# EAGLE design bga614_lna (EAGLE 9.6.2)
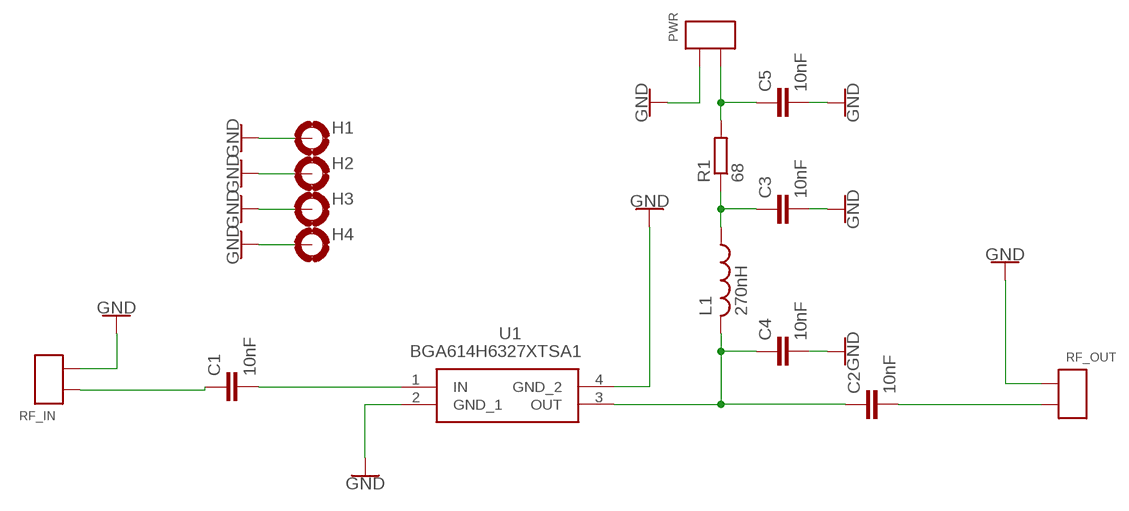
[diagram p0: schematic, sheet 1]

## Parts
C1  10nF  C_0805_SMD  [C0805]
C2  10nF  C_0805_SMD  [C0805]
C3  10nF  C_0805_SMD  [C0805]
C4  10nF  C_0805_SMD  [C0805]
C5  10nF  C_0805_SMD  [C0805]
H1  MOUNT-PAD-ROUND3.0  [3,0-PAD]
H2  MOUNT-PAD-ROUND3.0  [3,0-PAD]
H3  MOUNT-PAD-ROUND3.0  [3,0-PAD]
H4  MOUNT-PAD-ROUND3.0  [3,0-PAD]
L1  270nH  L_0805_PTH  [M0805]
PWR  2X_SMD_PTH_PIN  [2X_SMD_PTH]
R1  68  R_0805_SMD  [R0805W]
RF_IN  2X_SMD_PTH_PIN  [2X_SMD_PTH]
RF_OUT  2X_SMD_PTH_PIN  [2X_SMD_PTH]
U1  BGA614H6327XTSA1  [BGA614H6327XTSA1]

## Nets
GND: C3.2 C4.2 C5.2 H1.B3,0(MOUNT) H2.B3,0(MOUNT) H3.B3,0(MOUNT) H4.B3,0(MOUNT) PWR.P$1(PIN0) PWR.T$1(PIN0) RF_IN.P$2(PIN1) RF_IN.T$2(PIN1) RF_OUT.P$1(PIN0) RF_OUT.T$1(PIN0) U1.2(GND_1) U1.4(GND_2)
N$1: C2.1 C4.1 L1.2 L1.P$2 U1.3(OUT)
N$2: C3.1 L1.1 L1.P$1 R1.1
N$3: C5.1 PWR.P$2(PIN1) PWR.T$2(PIN1) R1.2
N$4: C2.2 RF_OUT.P$2(PIN1) RF_OUT.T$2(PIN1)
N$5: C1.2 U1.1(IN)
N$6: C1.1 RF_IN.P$1(PIN0) RF_IN.T$1(PIN0)

## Library data of the parts
C1-C5 = mylib:C_0805_SMD
H1-H4 = holes:MOUNT-PAD-ROUND: MOUNTING PAD, round
L1 = mylib:L_0805_PTH
PWR RF_IN RF_OUT = mylib:2X_SMD_PTH_PIN
R1 = mylib:R_0805_SMD
U1 = BGA614H6327XTSA1:BGA614H6327XTSA1: INFINEON - BGA614H6327XTSA1 - MMIC AMP, 17.5DB, 0-2.4GHZ, SOT-343-4 Source: Datasheet <https://www.infineon.com/dgdl/BGA614.pdf?folderId=db3a30431441fb5d0114b654e6581730&fileId=db3a304314dca3890115418ffd35163a>; ARROW_PART_NUMBER: BGA614H6327XTSA1; ARROW_PRICE-STOCK: https://www.arrow.com/en/products/bga614h6327xtsa1/infineon-technologies-ag; DESCRIPTION: INFINEON - BGA614H6327XTSA1 - MMIC AMP, 17.5DB, 0-2.4GHZ, SOT-343-4; HEIGHT: 1mm; MANUFACTURER_NAME: Infineon; MANUFACTURER_PART_NUMBER: BGA614H6327XTSA1; MOUSER_PART_NUMBER: 726-BGA614H6327XTSA1; MOUSER_PRICE-STOCK: https://www.mouser.co.uk/ProductDetail/Infineon-Technologies/BGA614H6327XTSA1?qs=K00xGehIljv3gDCSGhHKEQ%3D%3D

## Board
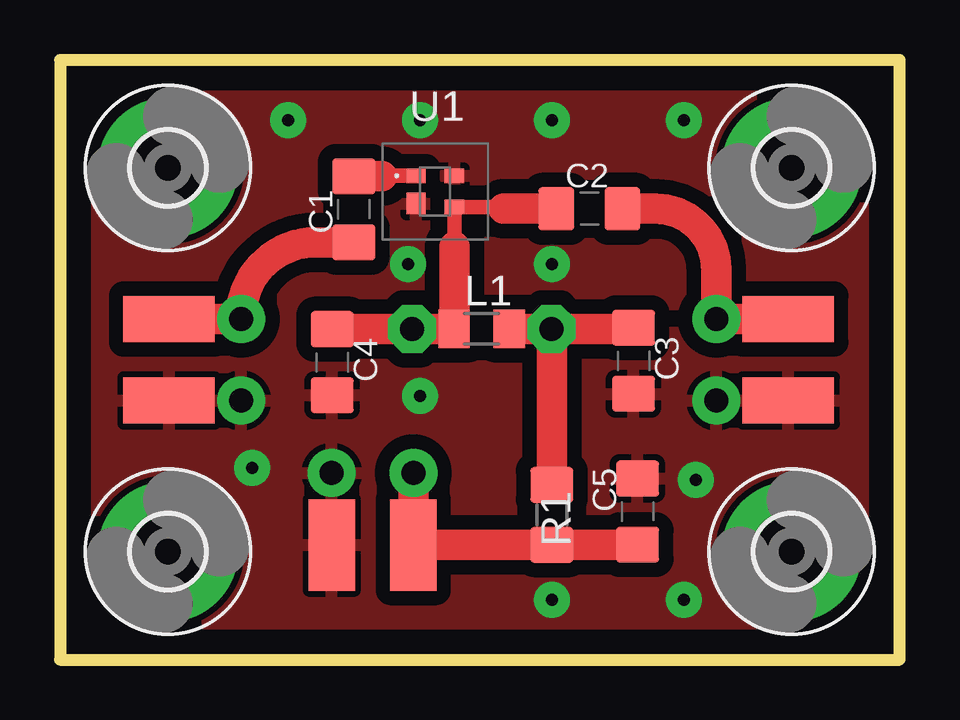
[diagram p1: board, top side]
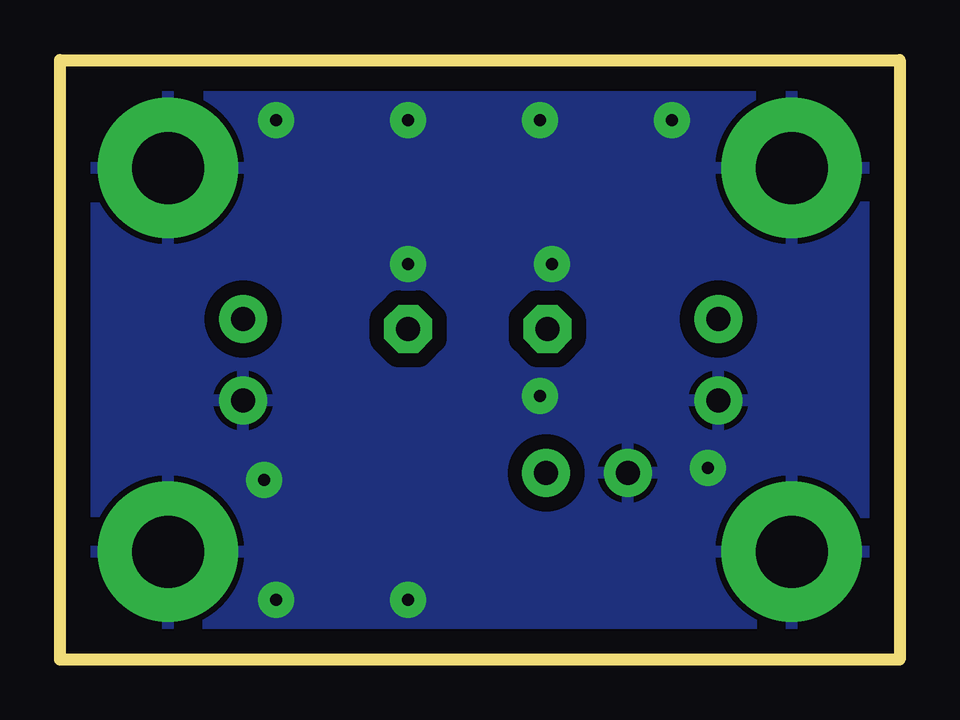
[diagram p2: board, bottom side, seen from below]

Size 35 x 25 mm. Coordinates in mm from the lower left corner, seen from the top.
Outline: 0,0 35,0 35,25 0,25 0,0
Copper layers (1*16): Top 0.035mm / dielectric 1.5mm / Bottom 0.035mm
Design rules "default": minimum track width 6mil, minimum drill 0.35mm, track to track 6mil, track to pad 6mil, pad to pad 6mil, via to via 6mil, smd to smd 6mil, copper to edge 40mil, drill to drill 6mil, minimum pad ring 10mil, minimum via ring 8mil, stop-mask expansion 4mil, vias tented up to drill 0mil, thermal gap 10mil

### Footprints (pad centres in the part's own frame; a part is rotated, then mirrored left to right if it is on the bottom)
C0805 = smd 1.5 x 1.8: 1 -1.377,0; 2 1.377,0
3,0-PAD = drill 3 pad 5.842: B3,0 0,0
M0805 = smd 1.3 x 1.6: 1 -1.15,0; 2 1.15,0 | drill 1 pad 2 octagon: P$1 -2.9,0; P$2 2.9,0
2X_SMD_PTH = smd 3.81 x 1.93: P$1 0,1.7; P$2 0,-1.7 | drill 1 pad 2: T$1 3,1.7; T$2 3,-1.7
R0805W = smd 1.5 x 1.8: 1 -1.252,0; 2 1.252,0
BGA614H6327XTSA1 = smd 0.6 x 0.8: 1 -0.65,-0.8; 3 0.65,0.8; 4 -0.65,0.8 | smd 0.9 x 0.8: 2 0.5,-0.8

### Placement (x,y rotation side)
C1  12.25,18.77 90 top
C2  22.07,18.8 0 top
C3  23.91,12.46 270 top
C4  11.35,12.4 270 top
C5  24.08,6.17 90 top
H1  30.5,4.5 0 top
H2  4.5,4.5 0 top
H3  4.5,20.5 0 top
H4  30.5,20.5 0 top
L1  17.58,13.79 180 top
PWR  13.03,4.78 90 top
R1  20.51,6.03 270 top
RF_IN  4.55,12.5 0 top
RF_OUT  30.36,12.5 180 top
U1  15.64,19.52 270 top

### Tracks (layer width: path | path; a pad name or v marks a point on that pad's centre or on a via)
GND  (via drill 0.5 pad 1.5)
  other vias: 9.5,22.5 15,22.5 20.5,22.5 26,22.5 26,2.5 20.5,2.5 8,8 15,11 20.5,16.5 14.5,16.5 26.5,7.5
  pour Top (isolate 0.6): 37,-2.5 -2,-2.5 -2,27 37,27
  pour Bottom (isolate 0.6): 36.5,-1.5 -1,-1.5 -1,26.5 36.5,26.5
N$1
  Top 0.61: 18.48,18.8 arc90 18.41,18.87 U1.3 16.44,17.21 16.45,17.21
  Top 1.27: 18.48,18.8 C2.1 | 16.45,17.21 16.45,13.79 L1.2 L1.P$2 14.67,13.78 C4.1
N$2
  Top 1.27: L1.1 L1.P$1 | L1.P$1 20.51,13.76 R1.1 | L1.P$1 23.86,13.79 arc90 C3.1
N$3
  Top 1.27: PWR.T$2 PWR.P$2 R1.2 24.06,4.78 C5.1
N$4
  Top 1.27: RF_OUT.P$2 RF_OUT.T$2 27.36,16.26 arc90 24.82,18.8 C2.2
N$5
  Top 0.61: U1.1 13.44,20.17 13.43,20.16
  Top 1.27: 13.43,20.16 12.26,20.16 arc90 C1.2
N$6
  Top 1.27: RF_IN.P$1 RF_IN.T$1 7.55,14.28 arc-90 10.66,17.39 C1.1